# EAGLE schematic Proto2-schematic v39 (EAGLE 9.7.0)
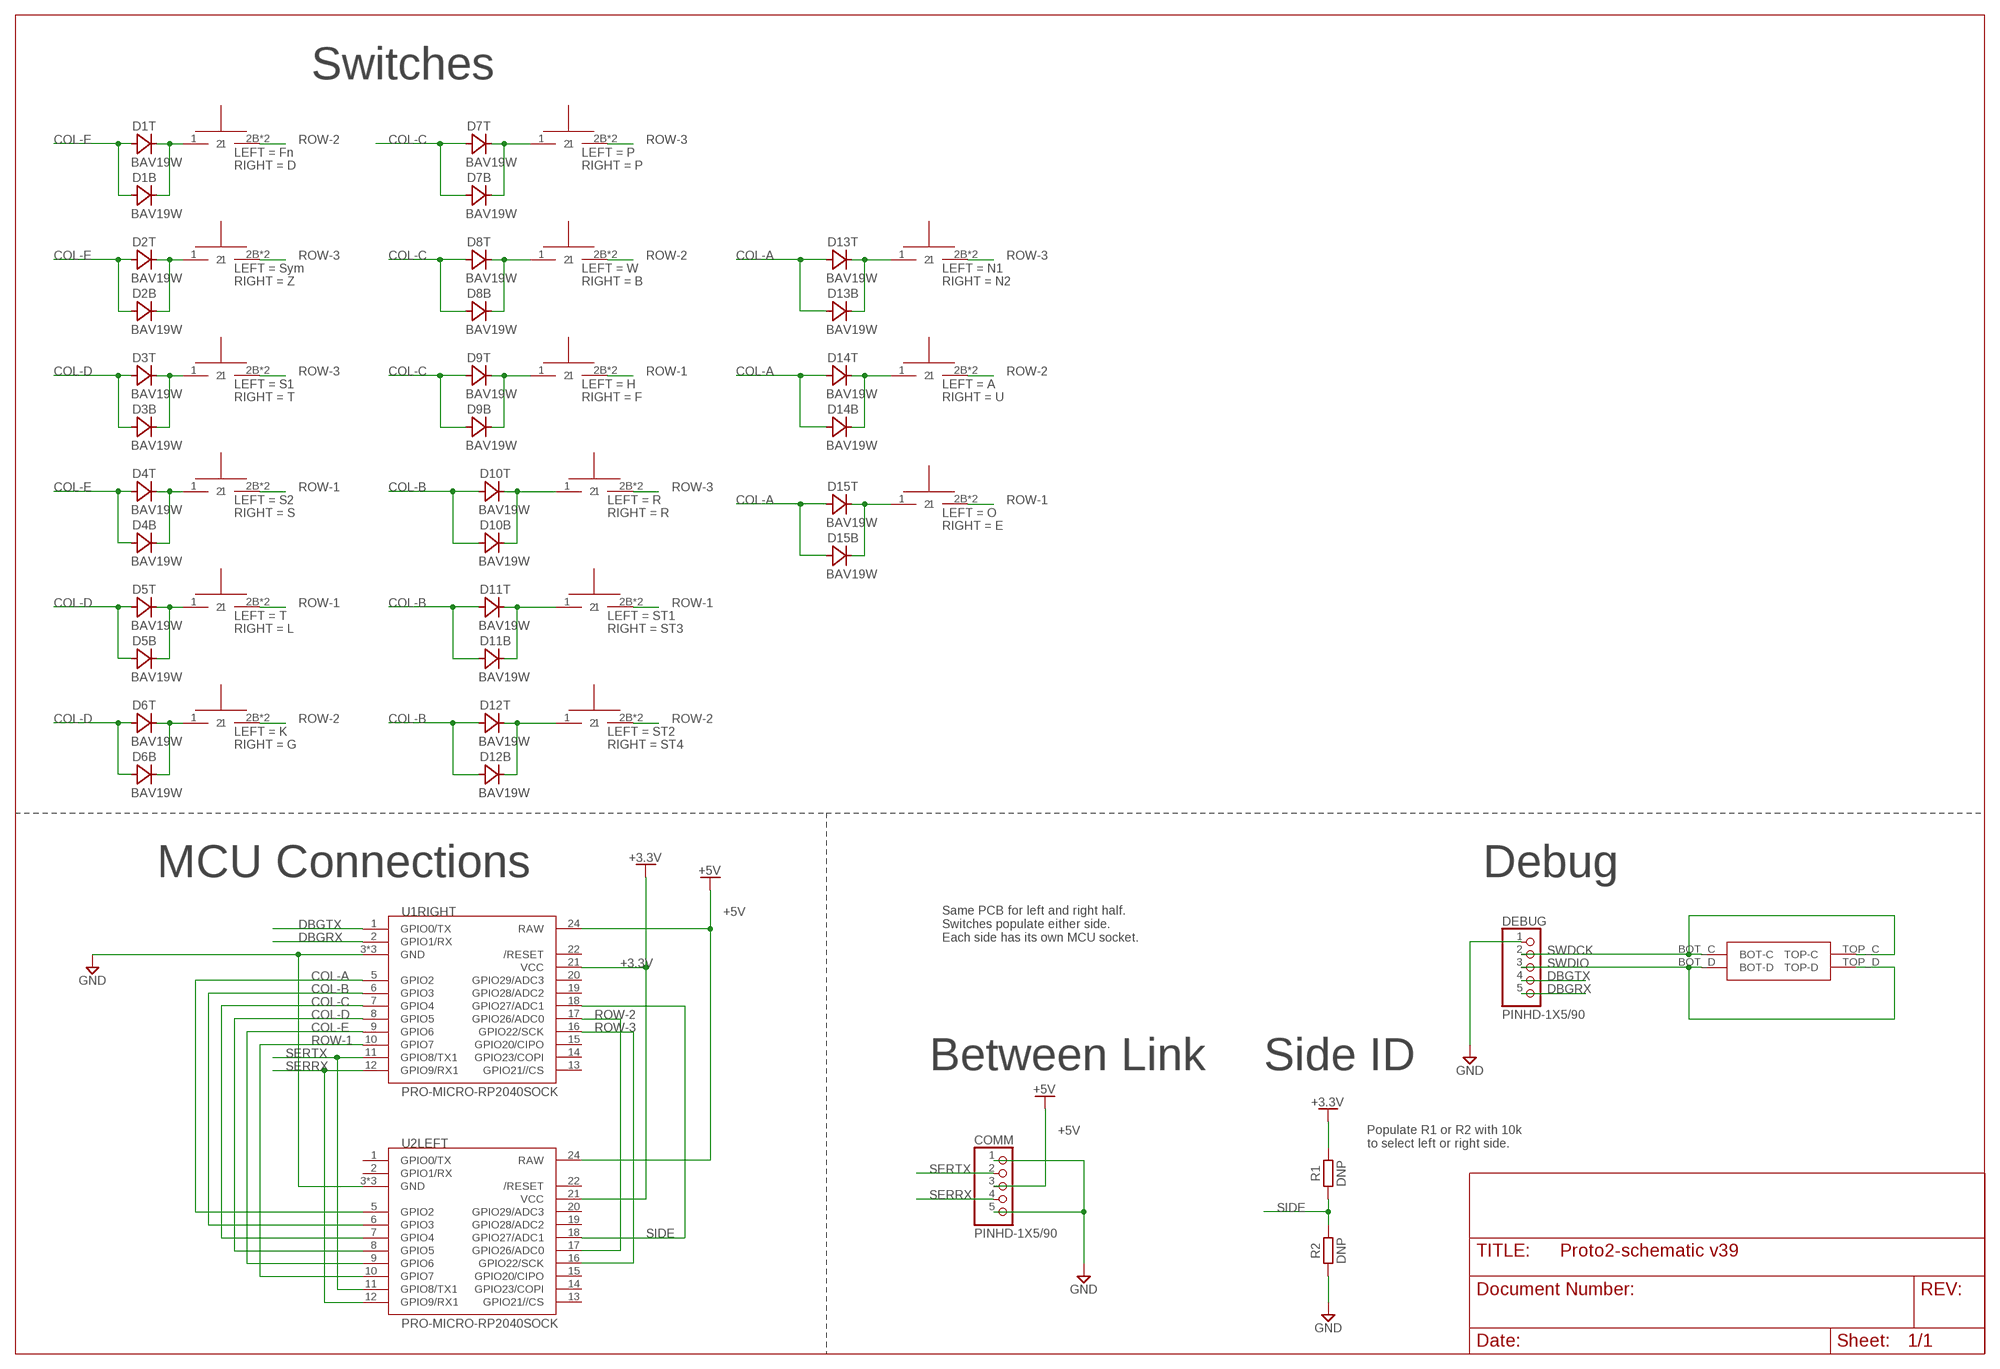
[diagram p0: schematic, sheet 1]

## Parts
COMM  PINHD-1X5/90  [1X05/90]
D1B  BAV19W  [SOD123]
D1T  BAV19W  [SOD123]
D2B  BAV19W  [SOD123]
D2T  BAV19W  [SOD123]
D3B  BAV19W  [SOD123]
D3T  BAV19W  [SOD123]
D4B  BAV19W  [SOD123]
D4T  BAV19W  [SOD123]
D5B  BAV19W  [SOD123]
D5T  BAV19W  [SOD123]
D6B  BAV19W  [SOD123]
D6T  BAV19W  [SOD123]
D7B  BAV19W  [SOD123]
D7T  BAV19W  [SOD123]
D8B  BAV19W  [SOD123]
D8T  BAV19W  [SOD123]
D9B  BAV19W  [SOD123]
D9T  BAV19W  [SOD123]
D10B  BAV19W  [SOD123]
D10T  BAV19W  [SOD123]
D11B  BAV19W  [SOD123]
D11T  BAV19W  [SOD123]
D12B  BAV19W  [SOD123]
D12T  BAV19W  [SOD123]
D13B  BAV19W  [SOD123]
D13T  BAV19W  [SOD123]
D14B  BAV19W  [SOD123]
D14T  BAV19W  [SOD123]
D15B  BAV19W  [SOD123]
D15T  BAV19W  [SOD123]
DEBUG  PINHD-1X5/90  [1X05/90]
R1  DNP  R_AXIAL-7.2MM-PITCH  [RESAD724W46L381D178B]
R2  DNP  R_AXIAL-7.2MM-PITCH  [RESAD724W46L381D178B]
SW-LFN-RD  PG1350-PINKA  [PG1350]
SW-LFN-RD1  PG1350-PINKA  [PG1350]
SW-LFN-RD2  PG1350-PINKA  [PG1350]
SW-LFN-RD3  PG1350-PINKA  [PG1350]
SW-LFN-RD4  PG1350-PINKA  [PG1350]
SW-LFN-RD5  PG1350-PINKA  [PG1350]
SW-LFN-RD6  PG1350-PINKA  [PG1350]
SW-LFN-RD7  PG1350-PINKA  [PG1350]
SW-LFN-RD8  PG1350-PINKA  [PG1350]
SW-LFN-RD9  PG1350-PINKA  [PG1350]
SW-LFN-RD10  PG1350-PINKA  [PG1350]
SW-LFN-RD11  PG1350-PINKA  [PG1350]
SW-LFN-RD12  PG1350-PINKA  [PG1350]
SW-LFN-RD13  PG1350-PINKA  [PG1350]
SW-LFN-RD14  PG1350-PINKA  [PG1350]
U1RIGHT  PRO-MICRO-RP2040SOCK  [PRO-MICRO-RP2040-SOCKETED]
U2LEFT  PRO-MICRO-RP2040SOCK  [PRO-MICRO-RP2040-SOCKETED]
U$3  SWD-TP-HEADER  [SWD-TP-HEADER]

## Nets
+3.3V: R1.2 U1RIGHT.21(VCC) U2LEFT.21(VCC)
+5V: COMM.3 U1RIGHT.24(RAW) U2LEFT.24(RAW)
COL-A: D13B.A D13T.A D14B.A D14T.A D15B.A D15T.A U1RIGHT.5(GPIO2) U2LEFT.5(GPIO2)
COL-B: D10B.A D10T.A D11B.A D11T.A D12B.A D12T.A U1RIGHT.6(GPIO3) U2LEFT.6(GPIO3)
COL-C: D7B.A D7T.A D8B.A D8T.A D9B.A D9T.A U1RIGHT.7(GPIO4) U2LEFT.7(GPIO4)
COL-D: D3B.A D3T.A D5B.A D5T.A D6B.A D6T.A U1RIGHT.8(GPIO5) U2LEFT.8(GPIO5)
COL-E: D1B.A D1T.A D2B.A D2T.A D4B.A D4T.A U1RIGHT.9(GPIO6) U2LEFT.9(GPIO6)
D12T: D12B.C D12T.C SW-LFN-RD11.1
D15T: D15B.C D15T.C SW-LFN-RD14.1
DBGRX: DEBUG.5 U1RIGHT.2(GPIO1/RX)
DBGTX: DEBUG.4 U1RIGHT.1(GPIO0/TX)
GND: COMM.1 COMM.5 DEBUG.1 R2.1 U1RIGHT.3(GND) U1RIGHT.4(GND) U1RIGHT.23(GND) U2LEFT.3(GND) U2LEFT.4(GND) U2LEFT.23(GND)
N$1: D1B.C D1T.C SW-LFN-RD.1
N$2: D2B.C D2T.C SW-LFN-RD1.1
N$3: D3B.C D3T.C SW-LFN-RD2.1
N$4: D4B.C D4T.C SW-LFN-RD3.1
N$5: D5B.C D5T.C SW-LFN-RD4.1
N$6: D6B.C D6T.C SW-LFN-RD5.1
N$7: D7B.C D7T.C SW-LFN-RD6.1
N$8: D8B.C D8T.C SW-LFN-RD7.1
N$9: D9B.C D9T.C SW-LFN-RD8.1
N$10: D10B.C D10T.C SW-LFN-RD9.1
N$12: D11B.C D11T.C SW-LFN-RD10.1
N$13: D13B.C D13T.C SW-LFN-RD12.1
N$14: D14B.C D14T.C SW-LFN-RD13.1
ROW-1: SW-LFN-RD3.2B SW-LFN-RD3.2T SW-LFN-RD4.2B SW-LFN-RD4.2T SW-LFN-RD8.2B SW-LFN-RD8.2T SW-LFN-RD10.2B SW-LFN-RD10.2T SW-LFN-RD14.2B SW-LFN-RD14.2T U1RIGHT.10(GPIO7) U2LEFT.10(GPIO7)
ROW-2: SW-LFN-RD5.2B SW-LFN-RD5.2T SW-LFN-RD7.2B SW-LFN-RD7.2T SW-LFN-RD11.2B SW-LFN-RD11.2T SW-LFN-RD13.2B SW-LFN-RD13.2T SW-LFN-RD.2B SW-LFN-RD.2T U1RIGHT.17(GPIO26/ADC0) U2LEFT.17(GPIO26/ADC0)
ROW-3: SW-LFN-RD1.2B SW-LFN-RD1.2T SW-LFN-RD2.2B SW-LFN-RD2.2T SW-LFN-RD6.2B SW-LFN-RD6.2T SW-LFN-RD9.2B SW-LFN-RD9.2T SW-LFN-RD12.2B SW-LFN-RD12.2T U1RIGHT.16(GPIO22/SCK) U2LEFT.16(GPIO22/SCK)
SERRX: COMM.4 U1RIGHT.12(GPIO9/RX1) U2LEFT.12(GPIO9/RX1)
SERTX: COMM.2 U1RIGHT.11(GPIO8/TX1) U2LEFT.11(GPIO8/TX1)
SIDE: R1.1 R2.2 U1RIGHT.18(GPIO27/ADC1) U2LEFT.18(GPIO27/ADC1)
SWDCK: DEBUG.2 U$3.BOT_C(BOT-C) U$3.TOP_C(TOP-C)
SWDIO: DEBUG.3 U$3.BOT_D(BOT-D) U$3.TOP_D(TOP-D)
Unconnected: U1RIGHT.13(GPIO21//CS) U1RIGHT.14(GPIO23/COPI) U1RIGHT.15(GPIO20/CIPO) U1RIGHT.19(GPIO28/ADC2) U1RIGHT.20(GPIO29/ADC3) U1RIGHT.22(/RESET) U2LEFT.1(GPIO0/TX) U2LEFT.2(GPIO1/RX) U2LEFT.13(GPIO21//CS) U2LEFT.14(GPIO23/COPI) U2LEFT.15(GPIO20/CIPO) U2LEFT.19(GPIO28/ADC2) U2LEFT.20(GPIO29/ADC3) U2LEFT.22(/RESET)

## Notes on the sheet
- Switches
- MCU Connections | Debug
- Same PCB for left and right half. 
  Switches populate either side. 
  Each side has its own MCU socket.
- Between Link | Side ID
- Populate R1 or R2 with 10k
  to select left or right side.

## Library data of the parts
COMM DEBUG = Connector:PINHD-1X5: PIN HEADER; CATEGORY: CONNECTOR; SUB-CATEGORY: PIN-HEADER
D1B D1T D2B D2T D3B D3T D4B D4T D5B D5T D6B D6T D7B D7T D8B D8T D9B D9T D10B D10T D11B D11T D12B D12T D13B D13T D14B D14T D15B D15T = Keyboard Parts:BAV19W
R1 R2 = Resistor:R: Resistor Fixed - Generic; CATEGORY: Resistor; SUB-CATEGORY: Fixed
SW-LFN-RD = Keyboard Parts:PG1350-PINK; LEFT: Fn; RIGHT: D
SW-LFN-RD1 = Keyboard Parts:PG1350-PINK; LEFT: Sym; RIGHT: Z
SW-LFN-RD2 = Keyboard Parts:PG1350-PINK; LEFT: S1; RIGHT: T
SW-LFN-RD3 = Keyboard Parts:PG1350-PINK; LEFT: S2; RIGHT: S
SW-LFN-RD4 = Keyboard Parts:PG1350-PINK; LEFT: T; RIGHT: L
SW-LFN-RD5 = Keyboard Parts:PG1350-PINK; LEFT: K; RIGHT: G
SW-LFN-RD6 = Keyboard Parts:PG1350-PINK; LEFT: P; RIGHT: P
SW-LFN-RD7 = Keyboard Parts:PG1350-PINK; LEFT: W; RIGHT: B
SW-LFN-RD8 = Keyboard Parts:PG1350-PINK; LEFT: H; RIGHT: F
SW-LFN-RD9 = Keyboard Parts:PG1350-PINK; LEFT: R; RIGHT: R
SW-LFN-RD10 = Keyboard Parts:PG1350-PINK; LEFT: ST1; RIGHT: ST3
SW-LFN-RD11 = Keyboard Parts:PG1350-PINK; LEFT: ST2; RIGHT: ST4
SW-LFN-RD12 = Keyboard Parts:PG1350-PINK; LEFT: N1; RIGHT: N2
SW-LFN-RD13 = Keyboard Parts:PG1350-PINK; LEFT: A; RIGHT: U
SW-LFN-RD14 = Keyboard Parts:PG1350-PINK; LEFT: O; RIGHT: E
U1RIGHT U2LEFT = Keyboard Parts:PRO-MICRO-RP2040
U$3 = Keyboard Parts:SWD-TP-HEADER